# Altium schematic sheet 5v_Regulator.SchDoc: 5V Battery Regulator
size A4; Organization: Altium Limited; Address1: L3, 12a Rodborough Rd; Address2: Frenchs Forest; Address3: NSW; Address4: Australia 2086
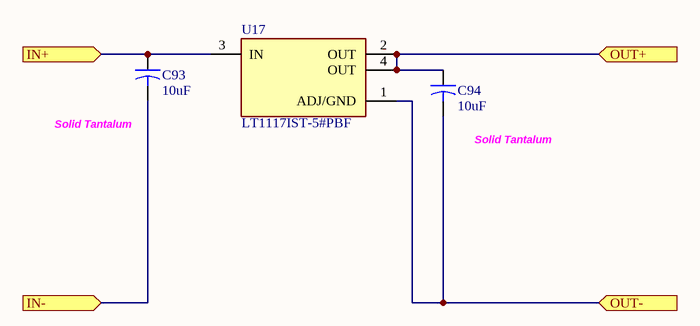
[diagram p0: 5v_Regulator.SchDoc]

## Parts
C93  10uF  [Tantalum_2917]
C94  10uF  [Tantalum_2917]
U17  LT1117IST-5#PBF  [REG_LT1117IST-5#PBF]

## Ports
IN+ (in), IN- (in), OUT+ (in), OUT- (in)

## Nets
IN+: C93.1 U17.3(IN) ; port IN+
IN-: C93.2 ; port IN-
OUT+: C94.1 U17.2(OUT) U17.4(OUT) ; port OUT+
OUT-: C94.2 U17.1(ADJ/GND) ; port OUT-

## Notes on the sheet
- (near C93) Solid Tantalum
- (near C94) Solid Tantalum
- Title
- Date:
- RE:
- Arturo di Girolamo
- Size:
- A3
- A

## Library data of the parts
C93 C94 = UVR1V102MHD1TO: Capacitor, 100uF NICHICON; ASYPN: T495D106K035ATE260; MFGPN: UVR1V102MHD1TO
U17 = LT1117IST-5#PBF: LDO Regulator Pos 5V 0.8A Automotive 4-Pin_3+Tab_ SOT-223 Tube; MF: Analog Devices; Value: *; Availability: Unavailable; Price: None; MP: LT1117IST-5#PBF; Package: SOT-223-3 Analog Devices; SnapEDA_Link: https://www.snapeda.com/parts/LT1117IST-5%23PBF/Analog%20Devices/view-part/4348177/?ref=snap; ASYPN: LT1117IST-5#PBF; Parameter 1: *